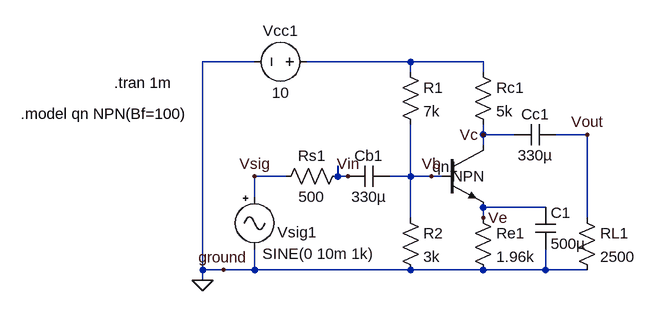
[diagram p0: schematic Draft5.asc]
Draft5.asc, the LTspice schematic file:
Version 4
SHEET 1 880 680
WIRE 192 192 112 192
WIRE 432 192 272 192
WIRE 544 192 432 192
WIRE 432 208 432 192
WIRE 544 208 544 192
WIRE 544 304 544 288
WIRE 592 304 544 304
WIRE 704 304 656 304
WIRE 544 320 544 304
WIRE 240 368 192 368
WIRE 320 368 320 352
WIRE 336 368 320 368
WIRE 432 368 432 288
WIRE 432 368 400 368
WIRE 464 368 432 368
WIRE 480 368 464 368
WIRE 192 400 192 368
WIRE 640 416 544 416
WIRE 432 432 432 368
WIRE 544 432 544 416
WIRE 704 432 704 304
WIRE 112 512 112 192
WIRE 144 512 112 512
WIRE 192 512 192 480
WIRE 192 512 144 512
WIRE 432 512 192 512
WIRE 544 512 432 512
WIRE 640 512 640 480
WIRE 640 512 544 512
WIRE 704 512 640 512
WIRE 112 528 112 512
FLAG 144 512 ground
FLAG 112 528 0
FLAG 544 432 Ve
FLAG 464 368 Vb
FLAG 704 304 Vout
FLAG 336 368 Vin
FLAG 192 368 Vsig
FLAG 544 304 Vc
SYMBOL voltage 288 192 R90
WINDOW 0 -32 56 VBottom 2
WINDOW 3 32 56 VTop 2
SYMATTR InstName Vcc1
SYMATTR Value 10
SYMBOL res 528 192 R0
SYMATTR InstName Rc1
SYMATTR Value 5k
SYMBOL res 416 192 R0
SYMATTR InstName R1
SYMATTR Value 7k
SYMBOL cap 656 288 R90
WINDOW 0 0 32 VBottom 2
WINDOW 3 32 32 VTop 2
SYMATTR InstName Cc1
SYMATTR Value 330µ
SYMBOL cap 400 352 R90
WINDOW 0 0 32 VBottom 2
WINDOW 3 32 32 VTop 2
SYMATTR InstName Cb1
SYMATTR Value 330µ
SYMBOL res 224 384 R270
WINDOW 0 32 56 VTop 2
WINDOW 3 0 56 VBottom 2
SYMATTR InstName Rs1
SYMATTR Value 500
SYMBOL res 416 416 R0
SYMATTR InstName R2
SYMATTR Value 3k
SYMBOL res 528 416 R0
SYMATTR InstName Re1
SYMATTR Value 1.96k
SYMBOL res 688 416 R0
SYMATTR InstName RL1
SYMATTR Value 2500
SYMBOL npn 480 320 R0
WINDOW 0 -14 33 Left 2
WINDOW 3 16 48 Left 2
SYMATTR InstName qn1
SYMBOL signal 192 384 R0
WINDOW 0 35 70 Left 2
WINDOW 3 12 103 Left 2
WINDOW 123 0 0 Left 2
WINDOW 39 0 0 Left 2
SYMATTR InstName Vsig1
SYMATTR Value SINE(0 10m 1k)
SYMBOL cap 624 416 R0
SYMATTR InstName C1
SYMATTR Value 500µ
TEXT -168 272 Left 2 !.model qn NPN(Bf=100)
TEXT -24 224 Left 2 !.tran 1m

The netlist it stands for:
* Draft5.asc
Vcc1 N001 0 10
Rc1 N001 Vc 5k
R1 N001 Vb 7k
Cc1 Vout Vc 330µ
Cb1 Vb Vin 330µ
Rs1 Vsig Vin 500
R2 Vb 0 3k
Re1 Ve 0 1.96k
RL1 Vout 0 2500
qn1 Vc Vb Ve 0 NPN
Vsig1 Vsig 0 SINE(0 10m 1k)
C1 Ve 0 500µ
.model NPN NPN
.model PNP PNP
.lib standard.bjt
.model qn NPN(Bf=100)
.tran 1m
.backanno
.end